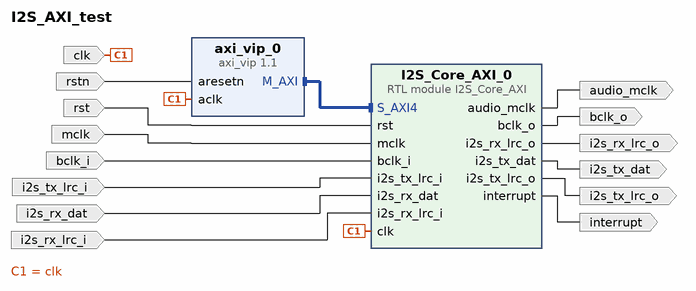
[diagram p0: block diagram of the top level]
# Vivado block design I2S_AXI_test, xc7z010clg400-1, Vivado 2020.1
create_bd_design I2S_AXI_test

create_bd_port -dir I -type clk clk
set_property -dict {CONFIG.FREQ_HZ 100000000} [get_bd_ports clk]
create_bd_port -dir I -type rst rst
set_property -dict {CONFIG.POLARITY ACTIVE_HIGH} [get_bd_ports rst]
create_bd_port -dir I mclk
create_bd_port -dir I bclk_i
create_bd_port -dir I i2s_tx_lrc_i
create_bd_port -dir I i2s_rx_dat
create_bd_port -dir I i2s_rx_lrc_i
create_bd_port -dir O audio_mclk
create_bd_port -dir O bclk_o
create_bd_port -dir O i2s_tx_dat
create_bd_port -dir O i2s_tx_lrc_o
create_bd_port -dir O i2s_rx_lrc_o
create_bd_port -dir I -type rst rstn
create_bd_port -dir O -type intr interrupt

create_bd_cell -type ip -vlnv xilinx.com:ip:axi_vip:1.1 axi_vip_0
set_property -dict [list \
  CONFIG.ADDR_WIDTH 32 \
  CONFIG.DATA_WIDTH 32 \
  CONFIG.HAS_BRESP 1 \
  CONFIG.HAS_PROT 1 \
  CONFIG.HAS_RRESP 1 \
  CONFIG.HAS_WSTRB 1 \
  CONFIG.INTERFACE_MODE MASTER \
  CONFIG.PROTOCOL AXI4LITE \
  CONFIG.READ_WRITE_MODE READ_WRITE \
] [get_bd_cells axi_vip_0]
create_bd_cell -type module -reference I2S_Core_AXI I2S_Core_AXI_0

# ---- connections ----

connect_bd_intf_net [get_bd_intf_pins axi_vip_0/M_AXI] [get_bd_intf_pins I2S_Core_AXI_0/S_AXI4]
connect_bd_net [get_bd_ports clk] [get_bd_pins axi_vip_0/aclk] [get_bd_pins I2S_Core_AXI_0/clk]
connect_bd_net [get_bd_ports rst] [get_bd_pins I2S_Core_AXI_0/rst]
connect_bd_net [get_bd_ports mclk] [get_bd_pins I2S_Core_AXI_0/mclk]
connect_bd_net [get_bd_ports bclk_i] [get_bd_pins I2S_Core_AXI_0/bclk_i]
connect_bd_net [get_bd_ports i2s_tx_lrc_i] [get_bd_pins I2S_Core_AXI_0/i2s_tx_lrc_i]
connect_bd_net [get_bd_ports i2s_rx_dat] [get_bd_pins I2S_Core_AXI_0/i2s_rx_dat]
connect_bd_net [get_bd_ports i2s_rx_lrc_i] [get_bd_pins I2S_Core_AXI_0/i2s_rx_lrc_i]
connect_bd_net [get_bd_pins I2S_Core_AXI_0/audio_mclk] [get_bd_ports audio_mclk]
connect_bd_net [get_bd_pins I2S_Core_AXI_0/bclk_o] [get_bd_ports bclk_o]
connect_bd_net [get_bd_pins I2S_Core_AXI_0/i2s_tx_dat] [get_bd_ports i2s_tx_dat]
connect_bd_net [get_bd_pins I2S_Core_AXI_0/i2s_tx_lrc_o] [get_bd_ports i2s_tx_lrc_o]
connect_bd_net [get_bd_pins I2S_Core_AXI_0/i2s_rx_lrc_o] [get_bd_ports i2s_rx_lrc_o]
connect_bd_net [get_bd_ports rstn] [get_bd_pins axi_vip_0/aresetn]
connect_bd_net [get_bd_pins I2S_Core_AXI_0/interrupt] [get_bd_ports interrupt]

# ---- address map ----
assign_bd_address -offset 0x00000000 -range 128 -target_address_space [get_bd_addr_spaces axi_vip_0/Master_AXI] [get_bd_addr_segs I2S_Core_AXI_0/S_AXI4/reg0]

validate_bd_design
save_bd_design
